# Altium schematic sheet mechanical.SchDoc: Mechanical
size Legal; CheckedBy: J. Brinton; CompanyName: Signal Laboratories, Inc.; DrawnBy: J. Brinton; Engineer: J. Brinton; Address1: 3479 Edison Way; Address2: Menlo Park CA 94025; Address3: +1 (877) 778-8435; Address4: siglabs.com; Revision: 3; SheetNumber: 49; SheetTotal: 49; ModifiedDate: 4/20/2018
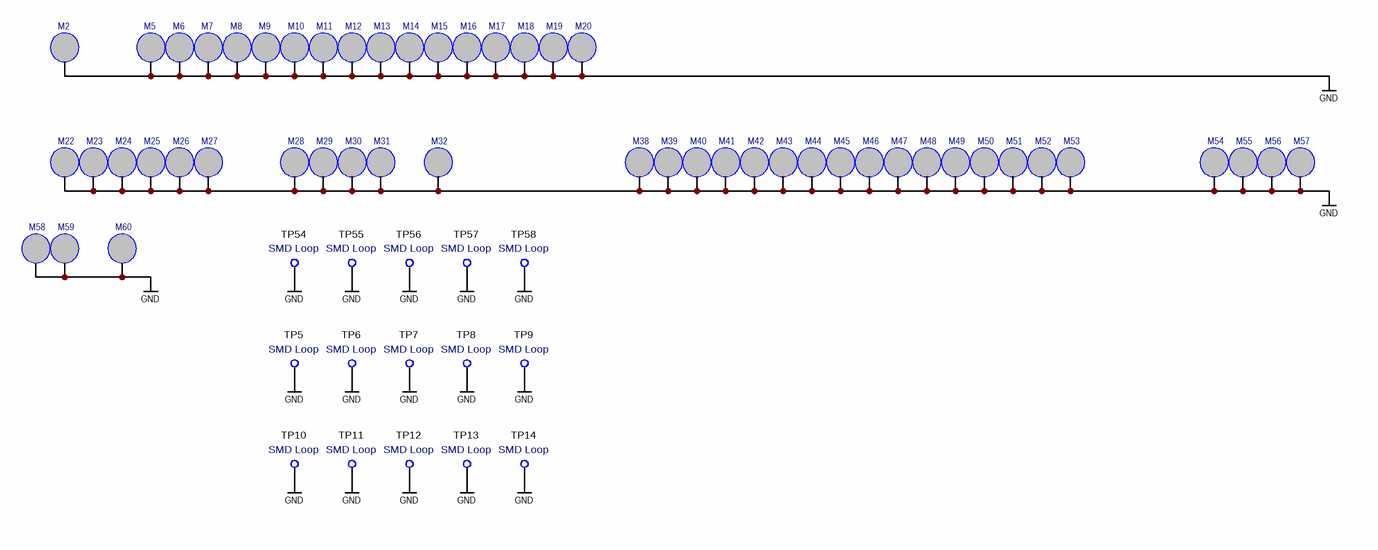
[diagram p0: mechanical.SchDoc]

## Parts
M2  MOUNT  [MOUNTM3]  (value not drawn)  (no BOM)
M5  MOUNT  [MOUNTM3]  (value not drawn)  (no BOM)
M6  MOUNT  [MOUNTM3]  (value not drawn)  (no BOM)
M7  MOUNT  [MOUNTM3]  (value not drawn)  (no BOM)
M8  MOUNT  [MOUNTM3]  (value not drawn)  (no BOM)
M9  MOUNT  [MOUNTM3]  (value not drawn)  (no BOM)
M10  MOUNT  [MOUNTM3]  (value not drawn)  (no BOM)
M11  MOUNT  [MOUNTM3]  (value not drawn)  (no BOM)
M12  MOUNT  [MOUNTM3]  (value not drawn)  (no BOM)
M13  MOUNT  [MOUNTM3]  (value not drawn)  (no BOM)
M14  MOUNT  [MOUNTM3]  (value not drawn)  (no BOM)
M15  MOUNT  [MOUNTM3]  (value not drawn)  (no BOM)
M16  MOUNT  [MOUNTM3]  (value not drawn)  (no BOM)
M17  MOUNT  [MOUNTM3]  (value not drawn)  (no BOM)
M18  MOUNT  [MOUNTM3]  (value not drawn)  (no BOM)
M19  MOUNT  [MOUNTM3]  (value not drawn)  (no BOM)
M20  MOUNT  [MOUNTM3]  (value not drawn)  (no BOM)
M22  MOUNT  [MOUNTM3]  (value not drawn)  (no BOM)
M23  MOUNT  [MOUNTM3]  (value not drawn)  (no BOM)
M24  MOUNT  [MOUNTM3]  (value not drawn)  (no BOM)
M25  MOUNT  [MOUNTM3]  (value not drawn)  (no BOM)
M26  MOUNT  [MOUNTM3]  (value not drawn)  (no BOM)
M27  MOUNT  [MOUNTM3]  (value not drawn)  (no BOM)
M28  MOUNT  [MOUNTM3]  (value not drawn)  (no BOM)
M29  MOUNT  [MOUNTM3]  (value not drawn)  (no BOM)
M30  MOUNT  [MOUNTM3]  (value not drawn)  (no BOM)
M31  MOUNT  [MOUNTM3]  (value not drawn)  (no BOM)
M32  MOUNT  [MOUNTM3]  (value not drawn)  (no BOM)
M38  MOUNT  [MOUNTM3]  (value not drawn)  (no BOM)
M39  MOUNT  [MOUNTM3]  (value not drawn)  (no BOM)
M40  MOUNT  [MOUNTM3]  (value not drawn)  (no BOM)
M41  MOUNT  [MOUNTM3]  (value not drawn)  (no BOM)
M42  MOUNT  [MOUNTM3]  (value not drawn)  (no BOM)
M43  MOUNT  [MOUNTM3]  (value not drawn)  (no BOM)
M44  MOUNT  [MOUNTM3]  (value not drawn)  (no BOM)
M45  MOUNT  [MOUNTM3]  (value not drawn)  (no BOM)
M46  MOUNT  [MOUNTM3]  (value not drawn)  (no BOM)
M47  MOUNT  [MOUNTM3]  (value not drawn)  (no BOM)
M48  MOUNT  [MOUNTM3]  (value not drawn)  (no BOM)
M49  MOUNT  [MOUNTM3]  (value not drawn)  (no BOM)
M50  MOUNT  [MOUNTM3]  (value not drawn)  (no BOM)
M51  MOUNT  [MOUNTM3]  (value not drawn)  (no BOM)
M52  MOUNT  [MOUNTM3]  (value not drawn)  (no BOM)
M53  MOUNT  [MOUNTM3]  (value not drawn)  (no BOM)
M54  MOUNT  [MOUNTM3]  (value not drawn)  (no BOM)
M55  MOUNT  [MOUNTM3]  (value not drawn)  (no BOM)
M56  MOUNT  [MOUNTM3]  (value not drawn)  (no BOM)
M57  MOUNT  [MOUNTM3]  (value not drawn)  (no BOM)
M58  MOUNT  [MOUNTM3]  (value not drawn)  (no BOM)
M59  MOUNT  [MOUNTM3]  (value not drawn)  (no BOM)
M60  MOUNT  [MOUNTM3]  (value not drawn)  (no BOM)
TP5  Notes: SMD Loop  [5015]  (hidden comment: 5015)
TP6  Notes: SMD Loop  [5015]  (hidden comment: 5015)
TP7  Notes: SMD Loop  [5015]  (hidden comment: 5015)
TP8  Notes: SMD Loop  [5015]  (hidden comment: 5015)
TP9  Notes: SMD Loop  [5015]  (hidden comment: 5015)
TP10  Notes: SMD Loop  [5015]  (hidden comment: 5015)
TP11  Notes: SMD Loop  [5015]  (hidden comment: 5015)
TP12  Notes: SMD Loop  [5015]  (hidden comment: 5015)
TP13  Notes: SMD Loop  [5015]  (hidden comment: 5015)
TP14  Notes: SMD Loop  [5015]  (hidden comment: 5015)
TP54  Notes: SMD Loop  [5015]  (hidden comment: 5015)
TP55  Notes: SMD Loop  [5015]  (hidden comment: 5015)
TP56  Notes: SMD Loop  [5015]  (hidden comment: 5015)
TP57  Notes: SMD Loop  [5015]  (hidden comment: 5015)
TP58  Notes: SMD Loop  [5015]  (hidden comment: 5015)

## Nets
GND: M2.1(MNT) M5.1(MNT) M6.1(MNT) M7.1(MNT) M8.1(MNT) M9.1(MNT) M10.1(MNT) M11.1(MNT) M12.1(MNT) M13.1(MNT) M14.1(MNT) M15.1(MNT) M16.1(MNT) M17.1(MNT) M18.1(MNT) M19.1(MNT) M20.1(MNT) M22.1(MNT) M23.1(MNT) M24.1(MNT) M25.1(MNT) M26.1(MNT) M27.1(MNT) M28.1(MNT) M29.1(MNT) M30.1(MNT) M31.1(MNT) M32.1(MNT) M38.1(MNT) M39.1(MNT) M40.1(MNT) M41.1(MNT) M42.1(MNT) M43.1(MNT) M44.1(MNT) M45.1(MNT) M46.1(MNT) M47.1(MNT) M48.1(MNT) M49.1(MNT) M50.1(MNT) M51.1(MNT) M52.1(MNT) M53.1(MNT) M54.1(MNT) M55.1(MNT) M56.1(MNT) M57.1(MNT) M58.1(MNT) M59.1(MNT) M60.1(MNT) TP5.1 TP6.1 TP7.1 TP8.1 TP9.1 TP10.1 TP11.1 TP12.1 TP13.1 TP14.1 TP54.1 TP55.1 TP56.1 TP57.1 TP58.1

## Notes on the sheet
- Title
- Engineer
- Revision
- Drawn By
- Checked By
- Date
- Sheet
- of

## Library data of the parts
TP5-TP14 TP54-TP58 = TEST_POINT_SMD_50: Test Point SMD; Manufacturer: Keystone; Manufacturer P/N: 5015